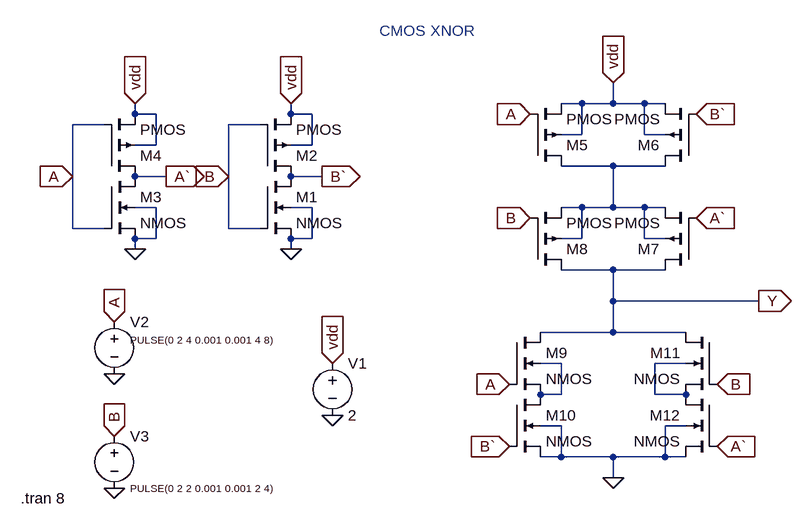
[diagram p0: schematic CMOS XNOR.asc]
CMOS XNOR.asc, the LTspice schematic file:
Version 4
SHEET 1 880 680
WIRE 368 -160 336 -160
WIRE 416 -160 416 -192
WIRE 416 -160 368 -160
WIRE 464 -160 416 -160
WIRE 496 -160 464 -160
WIRE -320 -144 -320 -160
WIRE -288 -144 -320 -144
WIRE -80 -144 -80 -160
WIRE -48 -144 -80 -144
WIRE -368 -128 -416 -128
WIRE -128 -128 -176 -128
WIRE 368 -112 368 -160
WIRE 368 -112 336 -112
WIRE 464 -112 464 -160
WIRE 496 -112 464 -112
WIRE -288 -96 -288 -144
WIRE -288 -96 -320 -96
WIRE -48 -96 -48 -144
WIRE -48 -96 -80 -96
WIRE 416 -64 336 -64
WIRE 496 -64 416 -64
WIRE -416 -48 -416 -128
WIRE -272 -48 -320 -48
WIRE -176 -48 -176 -128
WIRE -32 -48 -80 -48
WIRE -288 0 -320 0
WIRE -48 0 -80 0
WIRE 368 0 336 0
WIRE 416 0 416 -64
WIRE 416 0 368 0
WIRE 464 0 416 0
WIRE 496 0 464 0
WIRE -416 32 -416 -48
WIRE -368 32 -416 32
WIRE -176 32 -176 -48
WIRE -128 32 -176 32
WIRE -288 48 -288 0
WIRE -288 48 -320 48
WIRE -48 48 -48 0
WIRE -48 48 -80 48
WIRE 368 48 368 0
WIRE 368 48 336 48
WIRE 464 48 464 0
WIRE 496 48 464 48
WIRE -320 64 -320 48
WIRE -80 64 -80 48
WIRE 416 96 336 96
WIRE 496 96 416 96
WIRE 416 144 416 96
WIRE 640 144 416 144
WIRE 416 192 416 144
WIRE 416 192 304 192
WIRE 528 192 416 192
WIRE 336 240 304 240
WIRE 528 240 480 240
WIRE 336 288 336 240
WIRE 336 288 304 288
WIRE 480 288 480 240
WIRE 528 288 480 288
WIRE 336 336 304 336
WIRE 528 336 496 336
WIRE 336 384 336 336
WIRE 336 384 304 384
WIRE 416 384 336 384
WIRE 496 384 496 336
WIRE 496 384 416 384
WIRE 528 384 496 384
WIRE 416 416 416 384
FLAG -416 -48 A
IOPIN -416 -48 In
FLAG -176 -48 B
IOPIN -176 -48 In
FLAG -272 -48 A`
IOPIN -272 -48 Out
FLAG -32 -48 B`
IOPIN -32 -48 Out
FLAG 416 -192 vdd
IOPIN 416 -192 In
FLAG 288 -144 A
IOPIN 288 -144 In
FLAG 256 272 A
IOPIN 256 272 In
FLAG -352 176 A
IOPIN -352 176 In
FLAG 288 16 B
IOPIN 288 16 In
FLAG 576 272 B
IOPIN 576 272 In
FLAG -352 352 B
IOPIN -352 352 In
FLAG 544 -144 B`
IOPIN 544 -144 In
FLAG 256 368 B`
IOPIN 256 368 In
FLAG 544 16 A`
IOPIN 544 16 In
FLAG 576 368 A`
IOPIN 576 368 In
FLAG -16 240 vdd
IOPIN -16 240 In
FLAG 416 416 0
FLAG -16 320 0
FLAG -352 256 0
FLAG -352 432 0
FLAG 640 144 Y
IOPIN 640 144 Out
FLAG -80 64 0
FLAG -320 64 0
FLAG -80 -160 vdd
IOPIN -80 -160 In
FLAG -320 -160 vdd
IOPIN -320 -160 In
SYMBOL nmos4 -128 -48 R0
SYMATTR InstName M1
SYMBOL pmos4 -128 -48 M180
SYMATTR InstName M2
SYMBOL nmos4 -368 -48 R0
SYMATTR InstName M3
SYMBOL pmos4 -368 -48 M180
SYMATTR InstName M4
SYMBOL pmos4 288 -64 M180
SYMATTR InstName M5
SYMBOL pmos4 544 -64 R180
SYMATTR InstName M6
SYMBOL pmos4 544 96 R180
SYMATTR InstName M7
SYMBOL pmos4 288 96 M180
SYMATTR InstName M8
SYMBOL nmos4 256 192 R0
SYMATTR InstName M9
SYMBOL nmos4 256 288 R0
SYMATTR InstName M10
SYMBOL nmos4 576 192 M0
SYMATTR InstName M11
SYMBOL nmos4 576 288 M0
SYMATTR InstName M12
SYMBOL voltage -16 224 R0
WINDOW 123 0 0 Left 0
WINDOW 39 0 0 Left 0
SYMATTR InstName V1
SYMATTR Value 2
SYMBOL voltage -352 160 R0
WINDOW 3 24 44 Left 1
WINDOW 123 0 0 Left 0
WINDOW 39 0 0 Left 0
SYMATTR InstName V2
SYMATTR Value PULSE(0 2 4 0.001 0.001 4 8)
SYMBOL voltage -352 336 R0
WINDOW 3 24 96 Left 1
WINDOW 123 0 0 Left 0
WINDOW 39 0 0 Left 0
SYMATTR InstName V3
SYMATTR Value PULSE(0 2 2 0.001 0.001 2 4)
TEXT -496 448 Left 2 !.tran 8
TEXT 56 -272 Left 2 ;CMOS XNOR

The netlist it stands for:
* CMOS XNOR.asc
M1 B` B 0 0 NMOS
M2 B` B vdd vdd PMOS
M3 A` A 0 0 NMOS
M4 A` A vdd vdd PMOS
M5 N001 A vdd vdd PMOS
M6 N001 B` vdd vdd PMOS
M7 Y A` N001 N001 PMOS
M8 Y B N001 N001 PMOS
M9 Y A N002 N002 NMOS
M10 N002 B` 0 0 NMOS
M11 Y B N003 N003 NMOS
M12 N003 A` 0 0 NMOS
V1 vdd 0 2
V2 A 0 PULSE(0 2 4 0.001 0.001 4 8)
V3 B 0 PULSE(0 2 2 0.001 0.001 2 4)
.model NMOS NMOS
.model PMOS PMOS
.lib standard.mos
.tran 8
* CMOS XNOR
.backanno
.end

* Results of the author's LTspice run, read from the files saved beside the schematic
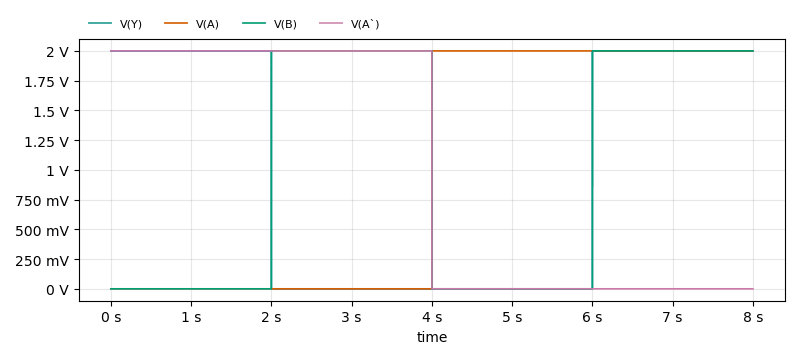
[diagram p1: Transient Analysis of CMOS XNOR.asc, plotted from the saved traces]
* Transient Analysis, 1 run:
*   V(Y): min 400.9 nV, max 2 V, average 1 V, rms 1.414 V, last 2 V
*   V(A): min 0 V, max 2 V, average 999.9 mV, rms 1.414 V, last 2 V
*   V(B): min 0 V, max 2 V, average 1 V, rms 1.414 V, last 2 V
*   V(A`): min 0 V, max 2 V, average 1 V, rms 1.414 V, last 0 V